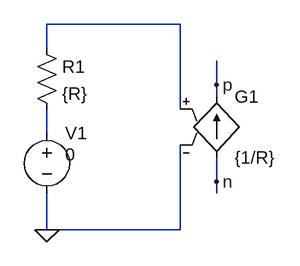
[diagram p0: schematic inoise.asc]
inoise.asc, the LTspice schematic file:
Version 4
SHEET 1 880 680
WIRE 352 64 176 64
WIRE 176 96 176 64
WIRE 400 144 400 112
WIRE 400 160 400 144
WIRE 352 176 352 64
WIRE 176 208 176 176
WIRE 400 272 400 240
WIRE 400 288 400 272
WIRE 176 336 176 288
WIRE 352 336 352 224
WIRE 352 336 176 336
FLAG 400 144 p
FLAG 400 272 n
FLAG 176 336 0
SYMBOL res 160 80 R0
SYMATTR InstName R1
SYMATTR Value {R}
SYMBOL voltage 176 192 R0
WINDOW 123 0 0 Left 2
WINDOW 39 0 0 Left 2
WINDOW 3 24 44 Left 2
SYMATTR InstName V1
SYMATTR Value 0
SYMBOL g 400 144 R0
SYMATTR InstName G1
SYMATTR Value {1/R}

The netlist it stands for:
* inoise.asc
R1 N001 N002 {R}
V1 N002 0 0
G1 n p N001 0 {1/R}
.backanno
.end